# EAGLE design MPVZ5010_pressureButton (EAGLE 8.3.2)
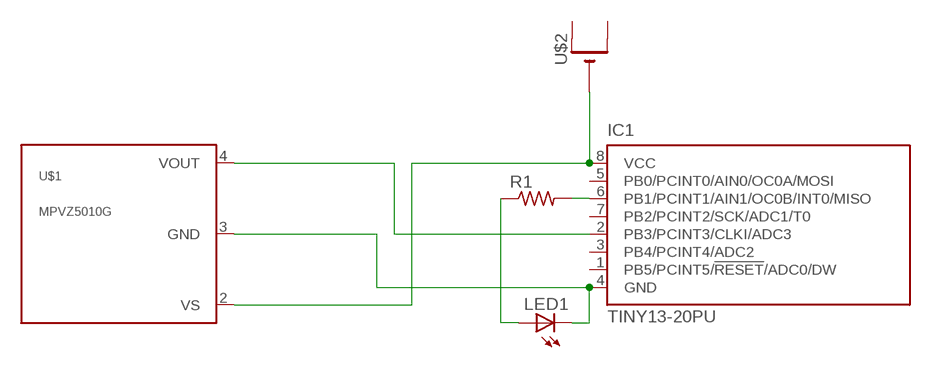
[diagram p0: schematic, sheet 1]

## Parts
IC1  TINY13-20PU  [DIL08]
LED1  LED3MM  [LED3MM]
R1  R-US_R0805  [R0805]
U$1  MPVZ5010G  [PVZ5010GW6U]
U$2  CR1220THM  [CR1220-THM]

## Nets
N$1: IC1.8(VCC) U$1.2(VS) U$2.-
N$2: IC1.4(GND) LED1.K(C) U$1.3(GND)
N$3: IC1.2(PB3/PCINT3/CLKI/ADC3) U$1.4(VOUT)
N$4: IC1.6(PB1/PCINT1/AIN1/OC0B/INT0/MISO) R1.2
N$5: LED1.A R1.1
Unconnected: IC1.1(PB5/PCINT5/!RESET!/ADC0/DW) IC1.3(PB4/PCINT4/ADC2) IC1.5(PB0/PCINT0/AIN0/OC0A/MOSI) IC1.7(PB2/PCINT2/SCK/ADC1/T0) U$2.+1(+) U$2.+2(+1)

## Library data of the parts
IC1 = atmel:TINY13: 8-bit AVR Microcontroller with 1K Bytes In-System Programmable Flash Source: http://www.atmel.com/dyn/resources/prod_documents/2535S.pdf; MPN: ATTINY13-20PU; OC_FARNELL: 9171550; OC_NEWARK: 96K6521
LED1 = adafruit:LED: LED OSRAM: - CHIPLED LG R971, LG N971, LY N971, LG Q971, LY Q971, LO R971, LY R971 LH N974, LH R974 LS Q976, LO Q976, LY Q976 LO Q996 - Hyper CHIPLED LW Q18S LB Q993, LB Q99A, LB R99A - SideLED LS A670, LO A670, LY A670, LG A670, LP A670 LB A673, LV A673, LT A673, LW A673 LH A674 LY A675 LS A676, LA A676, LO A676, LY A676, LW A676 LS A679, LY A679, LG A679 - Hyper Micro SIDELED® LS Y876, LA Y876, LO Y876, LY Y876 LT Y87S - SmartLED LW L88C, LW L88S LB L89C, LB L89S, LG L890 LS L89K, LO L89K, LY L89K LS L896, LA L896, LO L896, LY L896 - TOPLED LS T670, LO T670, LY T670, LG T670, LP T670 LSG T670, LSP T670, LSY T670, LOP T670, LYG T670 LG T671, LOG T671, LSG T671 LB T673, LV T673, LT T673, LW T673 LH T674 LS T676, LA T676, LO T676, LY T676, LB T676, LH T676, LSB T676, LW T676 LB T67C, LV T67C, LT T67C, LS T67K, LO T67K, LY T67K, LW E67C LS E67B, LA E67B, LO E67B, LY E67B, LB E67C, LV E67C, LT E67C LW T67C LS T679, LY T679, LG T679 LS T770, LO T770, LY T770, LG T770, LP T770 LB T773, LV T773, LT T773, LW T773 LH T774 LS E675, LA E675, LY E675, LS T675 LS T776, LA T776, LO T776, LY T776, LB T776 LHGB T686 LT T68C, LB T68C - Hyper Mini TOPLED® LB M676 - Mini TOPLED Santana® LG M470 LS M47K, LO M47K, LY M47K Source: http://www.osram.convergy.de/
R1 = rcl:R-US_: RESISTOR, American symbol
U$1 = MPVZ5010:MPVZ5010G: The MPVZ5010G series piezoresistive transducers are state-of-the-art monolithic silicon pressure sensors designed for the appliance, consumer, healthcare, industrial and automotive market. The analog output can be read directly into the A/D input of Freesca le microcontrollers. This transducer combines advanced micromachining tec hniques, thin-film metallization, and bipolar processing to provide an accurate, high level analog output signal that is proportional to the applied pressure. The axial port has been modified to accommodate industrial grade tubing
U$2 = adafruit:CR1220: CR1216/CR1220/CR1225 12mm 3V lithium coin cell Great for battery packup. Both SMT and THM holders. Note the THM package has the ground pads on both sides of the PCB so that the masks are the same - this reduces the cost

## Board
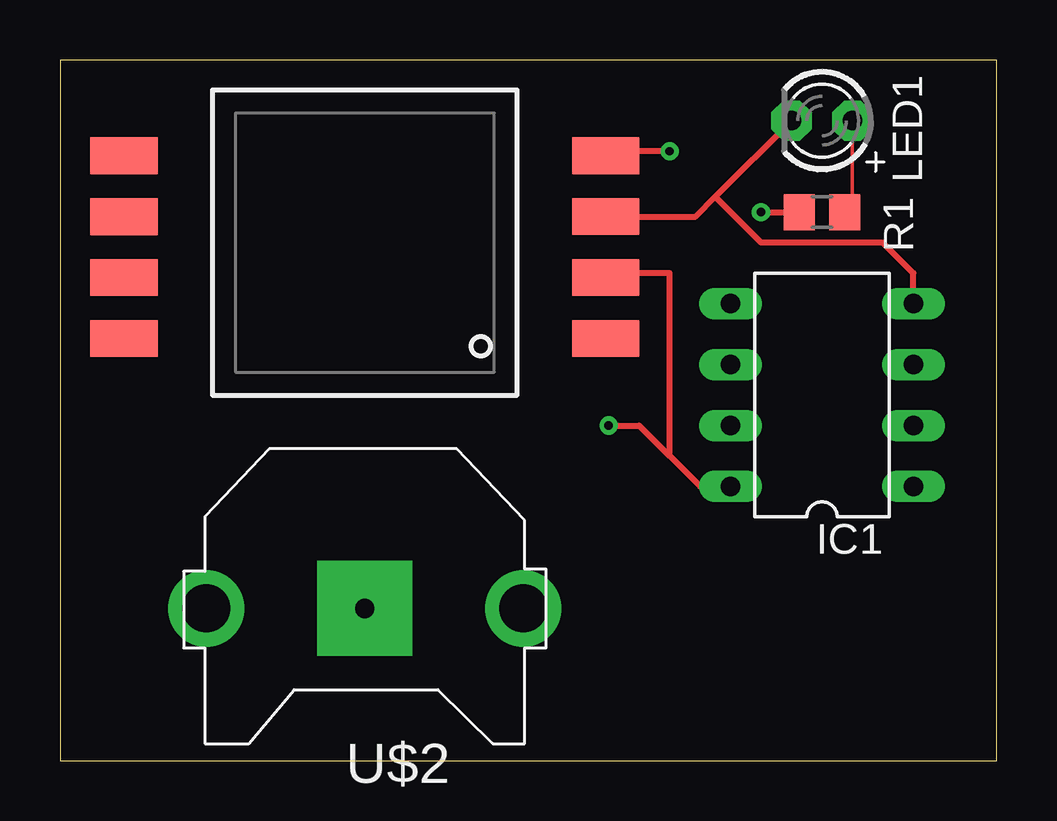
[diagram p1: board, top side]
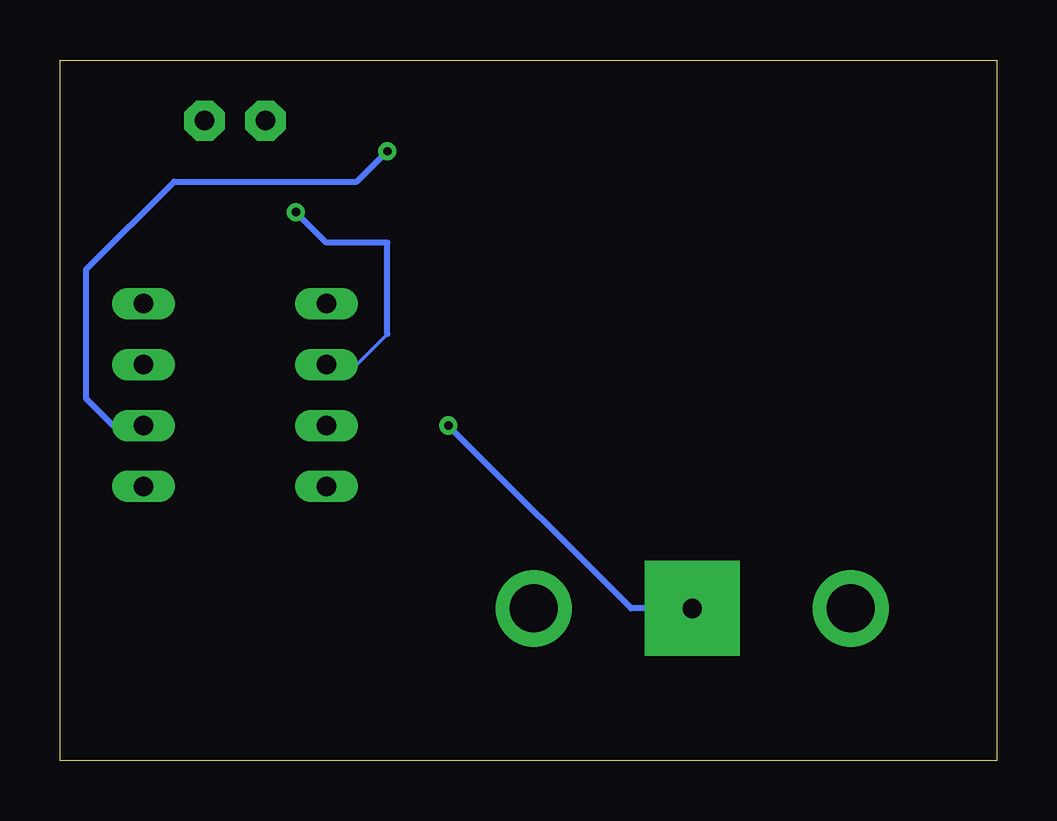
[diagram p2: board, bottom side, seen from below]

Size 39.04 x 29.2 mm. Coordinates in mm from the lower left corner, seen from the top.
Outline: 0,0 39.04,0 39.04,29.2 0,29.2 0,0
Copper layers (1*16): Top 0.035mm / dielectric 1.5mm / Bottom 0.035mm
Design rules "default": minimum track width 6mil, minimum drill 0.35mm, track to track 6mil, track to pad 6mil, pad to pad 6mil, via to via 6mil, smd to smd 6mil, copper to edge 40mil, drill to drill 6mil, minimum pad ring 10mil, minimum via ring 8mil, stop-mask expansion 4mil, vias tented up to drill 0mil, thermal gap 10mil

### Footprints (pad centres in the part's own frame; a part is rotated, then mirrored left to right if it is on the bottom)
DIL08 = drill 0.813 long: 1 -3.81,-3.81; 2 -1.27,-3.81; 3 1.27,-3.81; 4 3.81,-3.81; 5 3.81,3.81; 6 1.27,3.81; 7 -1.27,3.81; 8 -3.81,3.81
LED3MM = drill 0.813 pad 1.676 octagon: A -1.27,0; K 1.27,0
R0805 = smd 1.3 x 1.5: 1 -0.95,0; 2 0.95,0
PVZ5010GW6U = smd 2.794 x 1.524: 1 10.033,-4; 2 10.033,-1.46; 3 10.033,1.082; 4 10.033,3.619; 5 -10.033,3.619; 6 -10.033,1.079; 7 -10.033,-1.46; 8 -10.033,-4
CR1220-THM = drill 2 pad 3.175: +1 -6.604,0; +2 6.604,0 | drill 0.8 pad 3.962 square: - 0,0

### Placement (x,y rotation side)
IC1  31.75,15.24 90 top
LED1  31.75,26.67 180 top
R1  31.75,22.86 180 top
U$1  12.7,21.59 0 top
U$2  12.7,6.35 180 top

### Tracks (layer width: path | path; a pad name or v marks a point on that pad's centre or on a via)
N$1  (via drill 0.35)
  Top 0.152: 26.67,11.43 25.4,12.7 | 22.92,20.32 U$1.2
  Top 0.254: IC1.8 26.67,11.43 24.13,13.97 v22.86,13.97 | 25.4,12.7 25.4,20.32 22.92,20.32
  Bottom 0.254: U$2.- 15.24,6.35 v22.86,13.97
N$2
  Top 0.254: U$1.3 26.48,22.67 27.3,23.5 | 27.3,23.5 LED1.K | IC1.4 35.56,20.32 34.29,21.59 29.21,21.59 27.3,23.5
N$3  (via drill 0.35)
  Top 0.152: 22.92,25.4 U$1.4
  Top 0.254: v25.4,25.4 22.92,25.4
  Bottom 0.254: IC1.2 36.83,13.97 37.95,15.09 37.95,20.47 34.29,24.13 26.67,24.13 v25.4,25.4
N$4  (via drill 0.35)
  Top 0.254: v29.21,22.86 R1.2
  Bottom 0.152: IC1.6 26.67,16.51 25.4,17.78
  Bottom 0.254: 25.4,17.78 25.4,21.59 27.94,21.59 v29.21,22.86
N$5
  Top 0.152: LED1.A 33.02,23.18 R1.1